# EAGLE design eTapper1main8 (EAGLE 8.2.2)
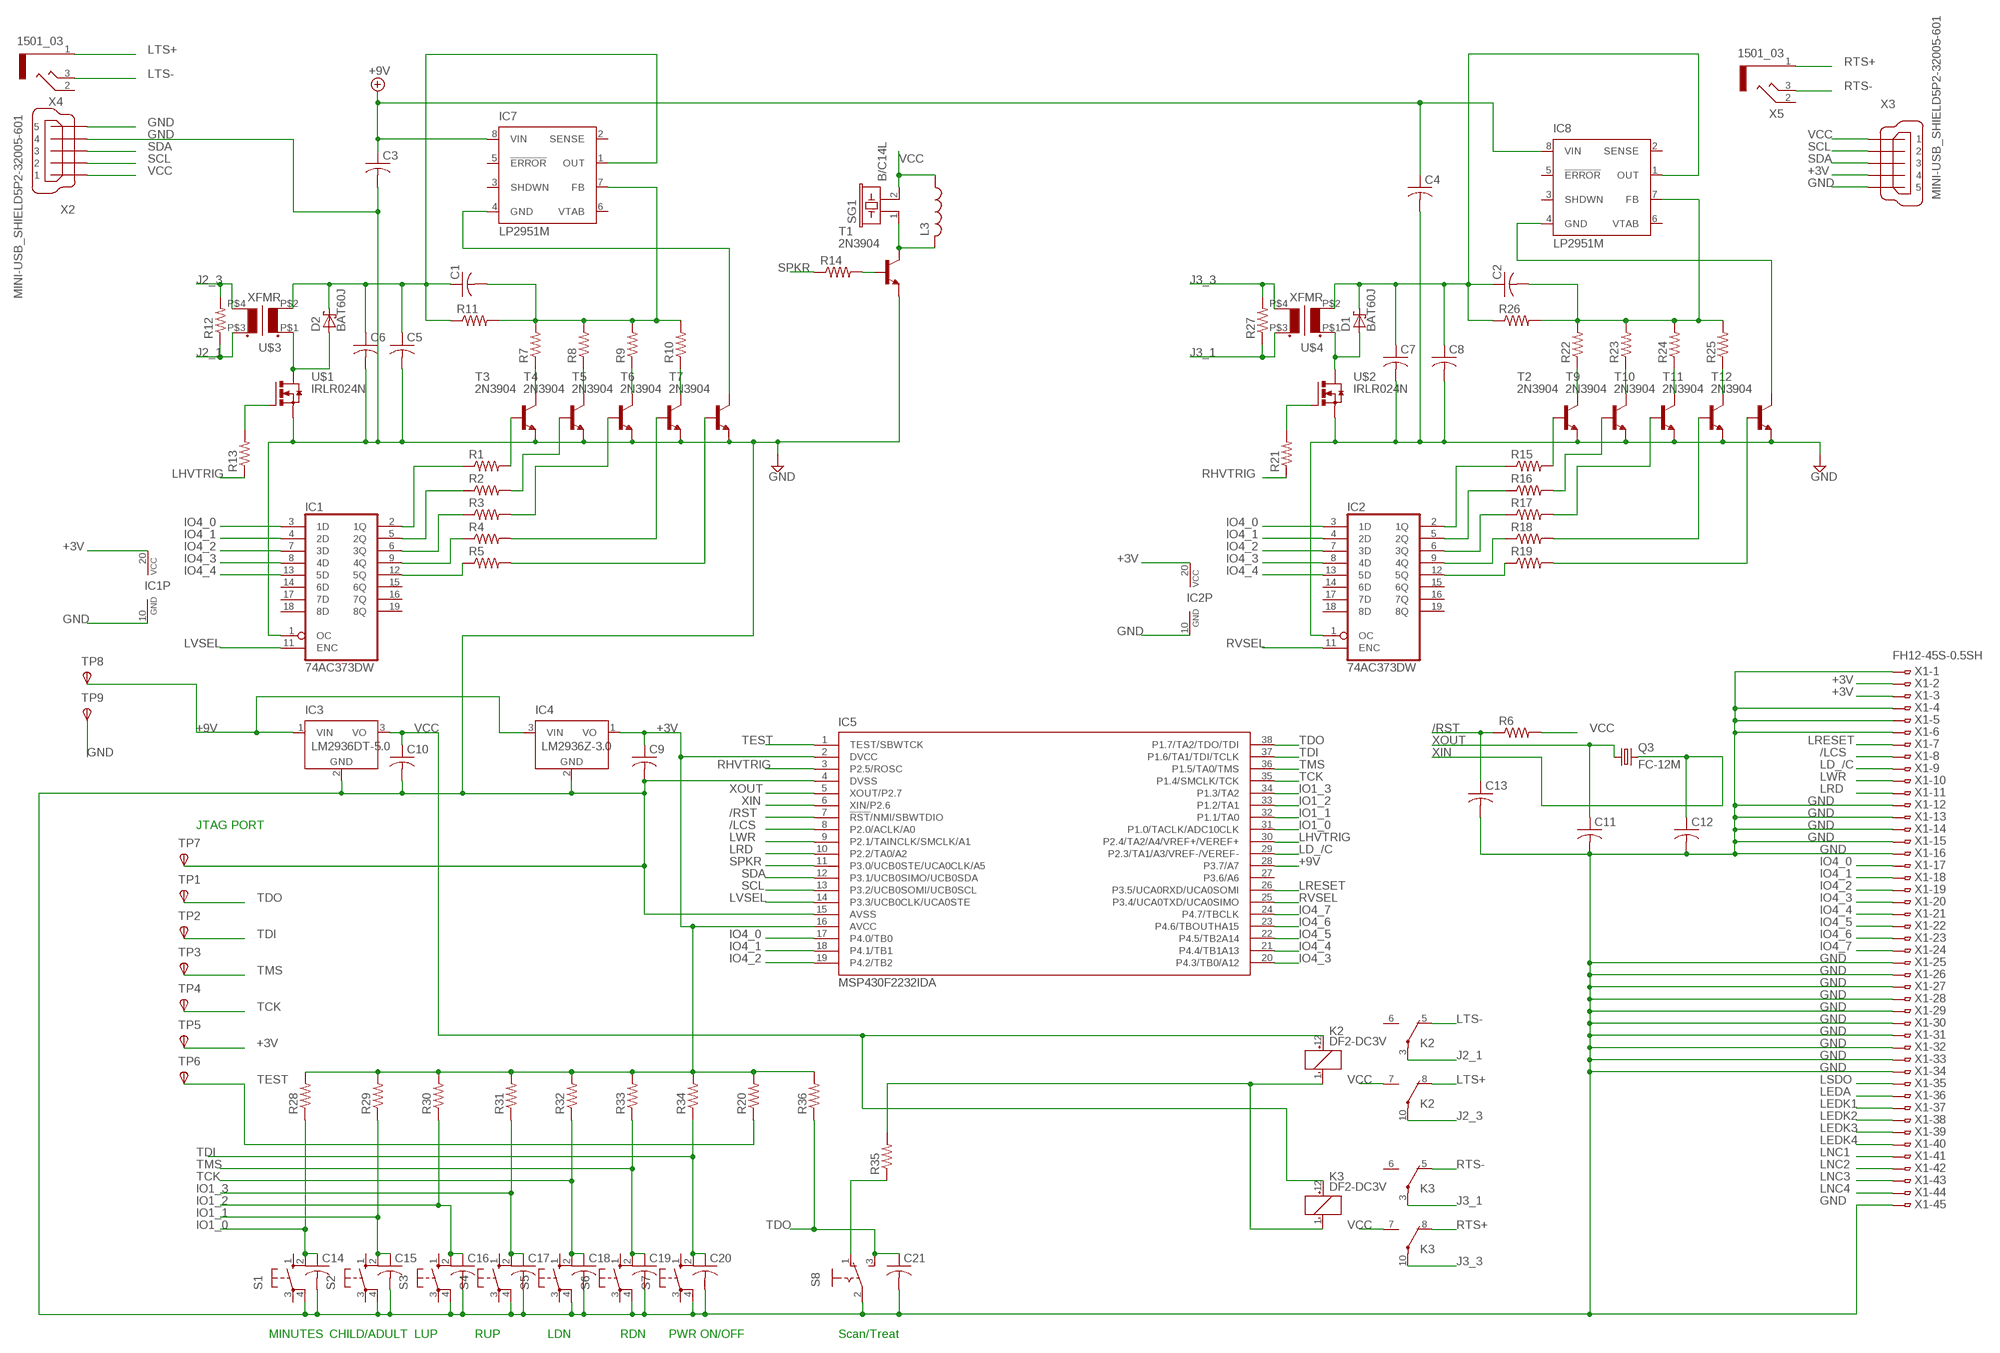
[diagram p0: schematic, sheet 1]

## Parts
C1  C-USC0805  [C0805]
C2  C-USC0805  [C0805]
C3  C-USC0805  [C0805]
C4  C-USC0805  [C0805]
C5  C-USC0805  [C0805]
C6  C-USC0805  [C0805]
C7  C-USC0805  [C0805]
C8  C-USC0805  [C0805]
C9  C-USC0805  [C0805]
C10  C-USC0805  [C0805]
C11  C-USC0805  [C0805]
C12  C-USC0805  [C0805]
C13  C-USC0805  [C0805]
C14  C-USC0805  [C0805]
C15  C-USC0805  [C0805]
C16  C-USC0805  [C0805]
C17  C-USC0805  [C0805]
C18  C-USC0805  [C0805]
C19  C-USC0805  [C0805]
C20  C-USC0805  [C0805]
C21  C-USC0805  [C0805]
D1  BAT60J  [SOD323_ST]
D2  BAT60J  [SOD323_ST]
IC1  74AC373DW  [SO20W]
IC2  74AC373DW  [SO20W]
IC3  LM2936DT-5.0  [TO252]
IC4  LM2936Z-3.0  [TO92]
IC5  MSP430F2232IDA  [TSSOP38_R-PDSO-G38-DA]
IC7  LP2951M  [SO08]
IC8  LP2951M  [SO08]
K2  DF2-DC3V  [DF2]
K3  DF2-DC3V  [DF2]
L3  L-USL2825P  [L2825P]
Q3  FC-12M  [FC-12M]
R1  R-US_R0402  [R0402]
R2  R-US_R0402  [R0402]
R3  R-US_R0402  [R0402]
R4  R-US_R0402  [R0402]
R5  R-US_R0402  [R0402]
R6  R-US_R0402  [R0402]
R7  R-US_R0402  [R0402]
R8  R-US_R0402  [R0402]
R9  R-US_R0402  [R0402]
R10  R-US_R0402  [R0402]
R11  R-US_R0402  [R0402]
R12  R-US_R0402  [R0402]
R13  R-US_R0402  [R0402]
R14  R-US_R0402  [R0402]
R15  R-US_R0402  [R0402]
R16  R-US_R0402  [R0402]
R17  R-US_R0402  [R0402]
R18  R-US_R0402  [R0402]
R19  R-US_R0402  [R0402]
R20  R-US_R0402  [R0402]
R21  R-US_R0402  [R0402]
R22  R-US_R0402  [R0402]
R23  R-US_R0402  [R0402]
R24  R-US_R0402  [R0402]
R25  R-US_R0402  [R0402]
R26  R-US_R0402  [R0402]
R27  R-US_R0402  [R0402]
R28  R-US_R0402  [R0402]
R29  R-US_R0402  [R0402]
R30  R-US_R0402  [R0402]
R31  R-US_R0402  [R0402]
R32  R-US_R0402  [R0402]
R33  R-US_R0402  [R0402]
R34  R-US_R0402  [R0402]
R35  R-US_R0402  [R0402]
R36  R-US_R0402  [R0402]
S1  10-XX  [B3F-10XX]
S2  10-XX  [B3F-10XX]
S3  10-XX  [B3F-10XX]
S4  10-XX  [B3F-10XX]
S5  10-XX  [B3F-10XX]
S6  10-XX  [B3F-10XX]
S7  10-XX  [B3F-10XX]
S8  M251  [M251]
SG1  B/C14L  [B/C14L]
T1  2N3904  [TO92]
T2  2N3904  [TO92]
T3  2N3904  [TO92]
T4  2N3904  [TO92]
T5  2N3904  [TO92]
T6  2N3904  [TO92]
T7  2N3904  [TO92]
T9  2N3904  [TO92]
T10  2N3904  [TO92]
T11  2N3904  [TO92]
T12  2N3904  [TO92]
TP1  TPSTP06R  [TP06R]
TP2  TPSTP06R  [TP06R]
TP3  TPSTP06R  [TP06R]
TP4  TPSTP06R  [TP06R]
TP5  TPSTP06R  [TP06R]
TP6  TPSTP06R  [TP06R]
TP7  TPSTP06R  [TP06R]
TP8  TPSTP06R  [TP06R]
TP9  TPSTP06R  [TP06R]
U$1  IRLR024N  [I-PAK_TO251AA]
U$2  IRLR024N  [I-PAK_TO251AA]
U$3  XFMR  [XFMR]
U$4  XFMR  [XFMR]
X1  FH12-45S-0.5SH  [FH12-45S-0.5SH]
X2  MINI-USB_SHIELD5P2-32005-601  [32005-601]
X3  MINI-USB_SHIELD5P2-32005-601  [32005-601]
X4  1501_03  [1501_03]
X5  1501_03  [1501_03]

## Nets
+3V: C9.1 IC1.20(VCC) IC2.20(VCC) IC4.1(VO) IC5.2(DVCC) IC5.16(AVCC) R20.2 R28.2 R29.2 R30.2 R31.2 R32.2 R33.2 R34.2 R36.2 TP5.TP(PP) X1.2 X1.3 X3.4
+9V: C3.1 C4.1 IC3.1(VIN) IC4.3(VIN) IC5.28(P3.7/A7) IC7.8(VIN) IC8.8(VIN) TP8.TP(PP)
/LCS: IC5.8(P2.0/ACLK/A0) X1.8
/RST: C13.1 IC5.7(!RST!/NMI/SBWTDIO) R6.1
GND: C3.2 C4.2 C5.2 C6.2 C7.2 C8.2 C9.2 C10.2 C11.2 C12.2 C13.2 C14.2 C15.2 C16.2 C17.2 C18.2 C19.2 C20.2 C21.2 IC1.1(OC) IC1.10(GND) IC2.1(OC) IC2.10(GND) IC3.2(GND) IC4.2(GND) IC5.4(DVSS) IC5.15(AVSS) S1.4(P1) S2.4(P1) S3.4(P1) S4.4(P1) S5.4(P1) S6.4(P1) S7.4(P1) S8.2(P) T1.3(E) T2.3(E) T3.3(E) T4.3(E) T5.3(E) T6.3(E) T7.3(E) T9.3(E) T10.3(E) T11.3(E) T12.3(E) TP7.TP(PP) TP9.TP(PP) U$1.3(S) U$2.3(S) X1.1 X1.4 X1.5 X1.6 X1.12 X1.13 X1.14 X1.15 X1.16 X1.25 X1.26 X1.27 X1.28 X1.29 X1.30 X1.31 X1.32 X1.33 X1.34 X1.45 X2.4 X2.5 X3.5
IO1_0: C14.1 IC5.31(P1.0/TACLK/ADC10CLK) R28.1 S1.2(S1)
IO1_1: C15.1 IC5.32(P1.1/TA0) R29.1 S2.2(S1)
IO1_2: C16.1 IC5.33(P1.2/TA1) R30.1 S3.2(S1)
IO1_3: C17.1 IC5.34(P1.3/TA2) R31.1 S4.2(S1)
IO4_0: IC1.3(1D) IC2.3(1D) IC5.17(P4.0/TB0) X1.17
IO4_1: IC1.4(2D) IC2.4(2D) IC5.18(P4.1/TB1) X1.18
IO4_2: IC1.7(3D) IC2.7(3D) IC5.19(P4.2/TB2) X1.19
IO4_3: IC1.8(4D) IC2.8(4D) IC5.20(P4.3/TB0/A12) X1.20
IO4_4: IC1.13(5D) IC2.13(5D) IC5.21(P4.4/TB1A13) X1.21
IO4_5: IC5.22(P4.5/TB2A14) X1.22
IO4_6: IC5.23(P4.6/TBOUTHA15) X1.23
IO4_7: IC5.24(P4.7/TBCLK) X1.24
J2_1: K2.3(2:P) R12.1 U$3.P$3(S1)
J2_3: K2.10(3:P) R12.2 U$3.P$4(S2)
J3_1: K3.3(2:P) R27.1 U$4.P$3(S1)
J3_3: K3.10(3:P) R27.2 U$4.P$4(S2)
LD_/C: IC5.29(P2.3/TA1/A3/VREF-/VEREF-) X1.9
LEDA: X1.36
LEDK1: X1.37
LEDK2: X1.38
LEDK3: X1.39
LEDK4: X1.40
LHVTRIG: IC5.30(P2.4/TA2/A4/VREF+/VEREF+) R13.1
LNC1: X1.41
LNC2: X1.42
LNC3: X1.43
LNC4: X1.44
LRD: IC5.10(P2.2/TA0/A2) X1.11
LRESET: IC5.26(P3.5/UCA0RXD/UCA0SOMI) X1.7
LSDO: X1.35
LTS+: K2.8(3:O) X4.1
LTS-: K2.5(2:O) X4.3
LVSEL: IC1.11(ENC) IC5.14(P3.3/UCB0CLK/UCA0STE)
LWR: IC5.9(P2.1/TAINCLK/SMCLK/A1) X1.10
N$1: IC1.2(1Q) R1.1
N$2: IC1.5(2Q) R2.1
N$3: IC1.6(3Q) R3.1
N$4: IC1.9(4Q) R4.1
N$5: IC1.12(5Q) R5.1
N$6: L3.2 SG1.1 T1.1(C)
N$7: R4.2 T6.2(B)
N$8: R5.2 T7.2(B)
N$9: D2.A U$1.2(D) U$1.4(D) U$3.P$1(P1)
N$10: R7.1 T3.1(C)
N$11: R8.1 T4.1(C)
N$12: R9.1 T5.1(C)
N$13: R1.2 T3.2(B)
N$14: R2.2 T4.2(B)
N$15: R3.2 T5.2(B)
N$16: R10.1 T6.1(C)
N$17: C1.2 IC7.7(FB) R7.2 R8.2 R9.2 R10.2 R11.2
N$18: C1.1 C5.1 C6.1 D2.C IC7.1(OUT) R11.1 U$3.P$2(P2)
N$19: D1.A U$2.2(D) U$2.4(D) U$4.P$1(P1)
N$20: IC2.2(1Q) R15.1
N$21: R13.2 U$1.1(G)
N$22: R14.2 T1.2(B)
N$23: R35.1 S8.1(O)
N$24: IC2.5(2Q) R16.1
N$25: IC2.6(3Q) R17.1
N$26: IC2.9(4Q) R18.1
N$27: IC2.12(5Q) R19.1
N$29: R15.2 T2.2(B)
N$30: R16.2 T9.2(B)
N$31: R17.2 T10.2(B)
N$32: R18.2 T11.2(B)
N$33: R19.2 T12.2(B)
N$34: K2.1(1:-) K3.1(1:-) R35.2
N$35: R22.1 T2.1(C)
N$36: R23.1 T9.1(C)
N$37: R24.1 T10.1(C)
N$38: R25.1 T11.1(C)
N$39: C2.2 IC8.7(FB) R22.2 R23.2 R24.2 R25.2 R26.2
N$40: C2.1 C7.1 C8.1 D1.C IC8.1(OUT) R26.1 U$4.P$2(P2)
N$42: R21.2 U$2.1(G)
N$45: IC7.4(GND) T7.1(C)
N$47: IC8.4(GND) T12.1(C)
RHVTRIG: IC5.3(P2.5/ROSC) R21.1
RTS+: K3.8(3:O) X5.1
RTS-: K3.5(2:O) X5.3
RVSEL: IC2.11(ENC) IC5.25(P3.4/UCA0TXD/UCA0SIMO)
SCL: IC5.13(P3.2/UCB0SOMI/UCB0SCL) X2.2 X3.2
SDA: IC5.12(P3.1/UCB0SIMO/UCB0SDA) X2.3 X3.3
SPKR: IC5.11(P3.0/UCB0STE/UCA0CLK/A5) R14.1
TCK: C18.1 IC5.35(P1.4/SMCLK/TCK) R32.1 S5.2(S1) TP4.TP(PP)
TDI: C20.1 IC5.37(P1.6/TA1/TDI/TCLK) R34.1 S7.2(S1) TP2.TP(PP)
TDO: C21.1 IC5.38(P1.7/TA2/TDO/TDI) R36.1 S8.3(S) TP1.TP(PP)
TEST: IC5.1(TEST/SBWTCK) R20.1 TP6.TP(PP)
TMS: C19.1 IC5.36(P1.5/TA0/TMS) R33.1 S6.2(S1) TP3.TP(PP)
VCC: C10.1 IC3.3(VO) K2.7(3:S) K2.12(1:+) K3.7(3:S) K3.12(1:+) L3.1 R6.2 SG1.2 X2.1 X3.1
XIN: C12.1 IC5.6(XIN/P2.6) Q3.2
XOUT: C11.1 IC5.5(XOUT/P2.7) Q3.1
Unconnected: IC1.14(6D) IC1.15(6Q) IC1.16(7Q) IC1.17(7D) IC1.18(8D) IC1.19(8Q) IC2.14(6D) IC2.15(6Q) IC2.16(7Q) IC2.17(7D) IC2.18(8D) IC2.19(8Q) IC5.27(P3.6/A6) IC7.2(SENSE) IC7.3(SHDWN) IC7.5(!ERROR) IC7.6(VTAB) IC8.2(SENSE) IC8.3(SHDWN) IC8.5(!ERROR) IC8.6(VTAB) K2.6(2:S) K3.6(2:S) S1.1(S) S1.3(P) S2.1(S) S2.3(P) S3.1(S) S3.3(P) S4.1(S) S4.3(P) S5.1(S) S5.3(P) S6.1(S) S6.3(P) S7.1(S) S7.3(P) X2.M1(S1) X2.M2(S2) X3.M1(S1) X3.M2(S2) X4.2 X5.2

## Notes on the sheet
- JTAG PORT
- MINUTES | CHILD/ADULT | LUP | RUP | LDN | RDN | PWR ON/OFF | Scan/Treat

## Library data of the parts
C1-C21 = rcl:C-US: CAPACITOR, American symbol
D1 D2 = diode:BAT60J: Schottky barrier diode Source: www.st.com, BAT60J.pdf
IC1 IC2 = 74xx-eu:74*373: Octal D type transparent LATCH, edge triggered
IC3 = national-semiconductor:LM2936?*: Ultra-Low Quiescent Current LDO Voltage Regulator Source: Data sheet <http://www.national.com/ds/LM/LM2936.pdf>; MF: NATIONAL SEMICONDUCTOR; MPN: LM2936DT-5.0/NOPB; OC_FARNELL: 1286864; OC_NEWARK: 41K4501
IC4 = national-semiconductor:LM2936?*: Ultra-Low Quiescent Current LDO Voltage Regulator Source: Data sheet <http://www.national.com/ds/LM/LM2936.pdf>; MF: NATIONAL SEMICONDUCTOR; MPN: LM2936Z-3.0/NOPB; OC_FARNELL: 1312709; OC_NEWARK: 41K4531
IC5 = texas:MSP430F22*2IDA: MIXED SIGNAL MICROCONTROLLER Source: http://focus.ti.com/lit/ds/symlink/msp430f2274.pdf; MPN: MSP430F2232IDA; OC_FARNELL: 1610178; OC_NEWARK: 28M6312
IC7 IC8 = national-semiconductor:LP2951: Adjustable Micropower Voltage Regulator Source: http://www.national.com/ds/LP/LP2950.pdf; MF: FAIRCHILD SEMICONDUCTOR; MPN: LP2951CM; OC_FARNELL: 9488561; OC_NEWARK: 78K6014
K2 K3 = relay:DF2-?DC*: HIGHLY SENSITIVE DIP MINIATURE RELAY NAiS Single side stable / 1 coil latching Source: http://www.mew-europe.com/.. en_ds_61002_0000.pdf; OC_FARNELL: unknown; OC_NEWARK: unknown
L3 = rcl:L-US: INDUCTOR, American symbol
Q3 = crystal:FC-12M: kHz RANGE CRYSTAL UNIT LOW PROFILE SMD Source: Epson Toyocom FC-12M.pdf
R1-R36 = resistor:R-US_: RESISTOR, American symbol
S1-S7 = switch-omron:10-XX: OMRON SWITCH; MPN: B3F-1000; OC_FARNELL: 176432; OC_NEWARK: 36M3542
S8 = switch:M251: SLIDING SWITCH Mors, distributor Buerklin, 11G702
SG1 = buzzer:B/C14L: BUZZER Source: Buerklin; OC_FARNELL: unknown; OC_NEWARK: unknown
T1-T7 T9-T12 = transistor-neu-to92:2N3904: NPN TRANSISTOR
TP1-TP9 = testpad:TPS: TEST PIN
U$1 U$2 = IRLR024N:IRLR024N: IRLR024N HEXFET Power Mosfet N channel Infeneon Technology TO-251AA IPAK
U$3 U$4 = XFMR:XFMR: Transformer 1"X1" 0.4"X0.4" hole separation for e_tapper
X1 = con-hirose:FH12-45S-0.5S: 0.5mm Pitch Connectors For FPC/FFC Source: Data sheet <http://www.hirose.co.jp/cataloge_hp/e58605370.pdf>; OC_FARNELL: unknown; OC_NEWARK: unknown
X2 X3 = con-cypressindustries:MINI-USB_SHIELD5P2-: MINI USB-B R/A DIP 5pol. Source: www.cypressindustries.com; OC_FARNELL: unknown; OC_NEWARK: unknown
X4 X5 = con-lumberg:1501_03: Klinkensteckverbinder nach JISC 6560, 2,5 mm Jack connectors according to JISC 6560, 2.5 mm Source: http://www.lumberg.com/Produkte/PDFs/1501_03.pdf; OC_FARNELL: 1200127; OC_NEWARK: unknown

## Module LP2951
Ports: 

### Library data of the parts

## Board
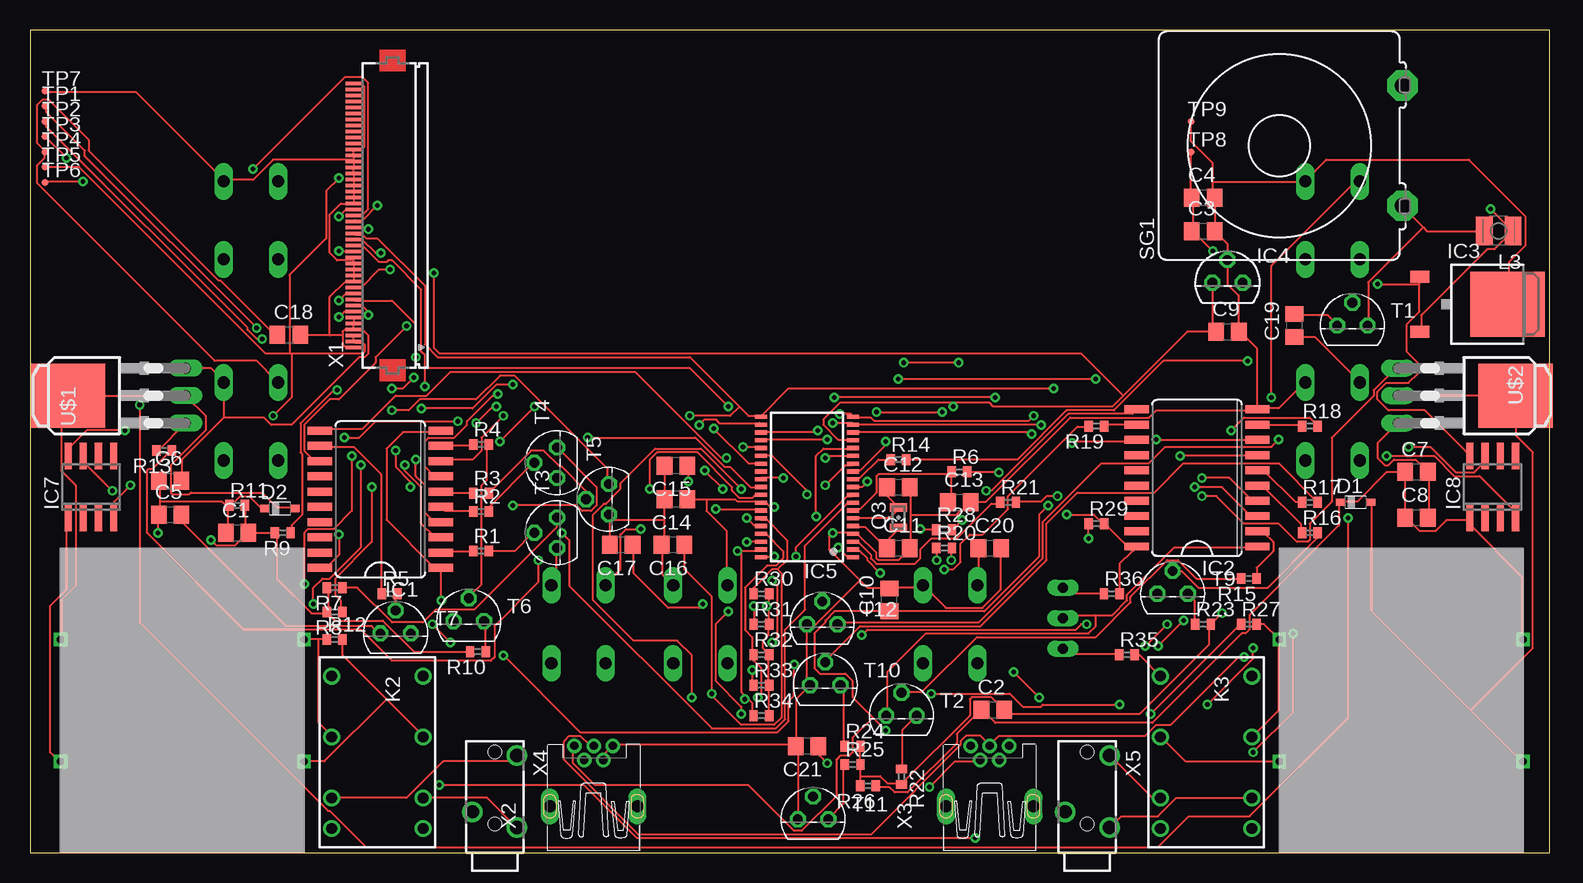
[diagram p1: board, top side]
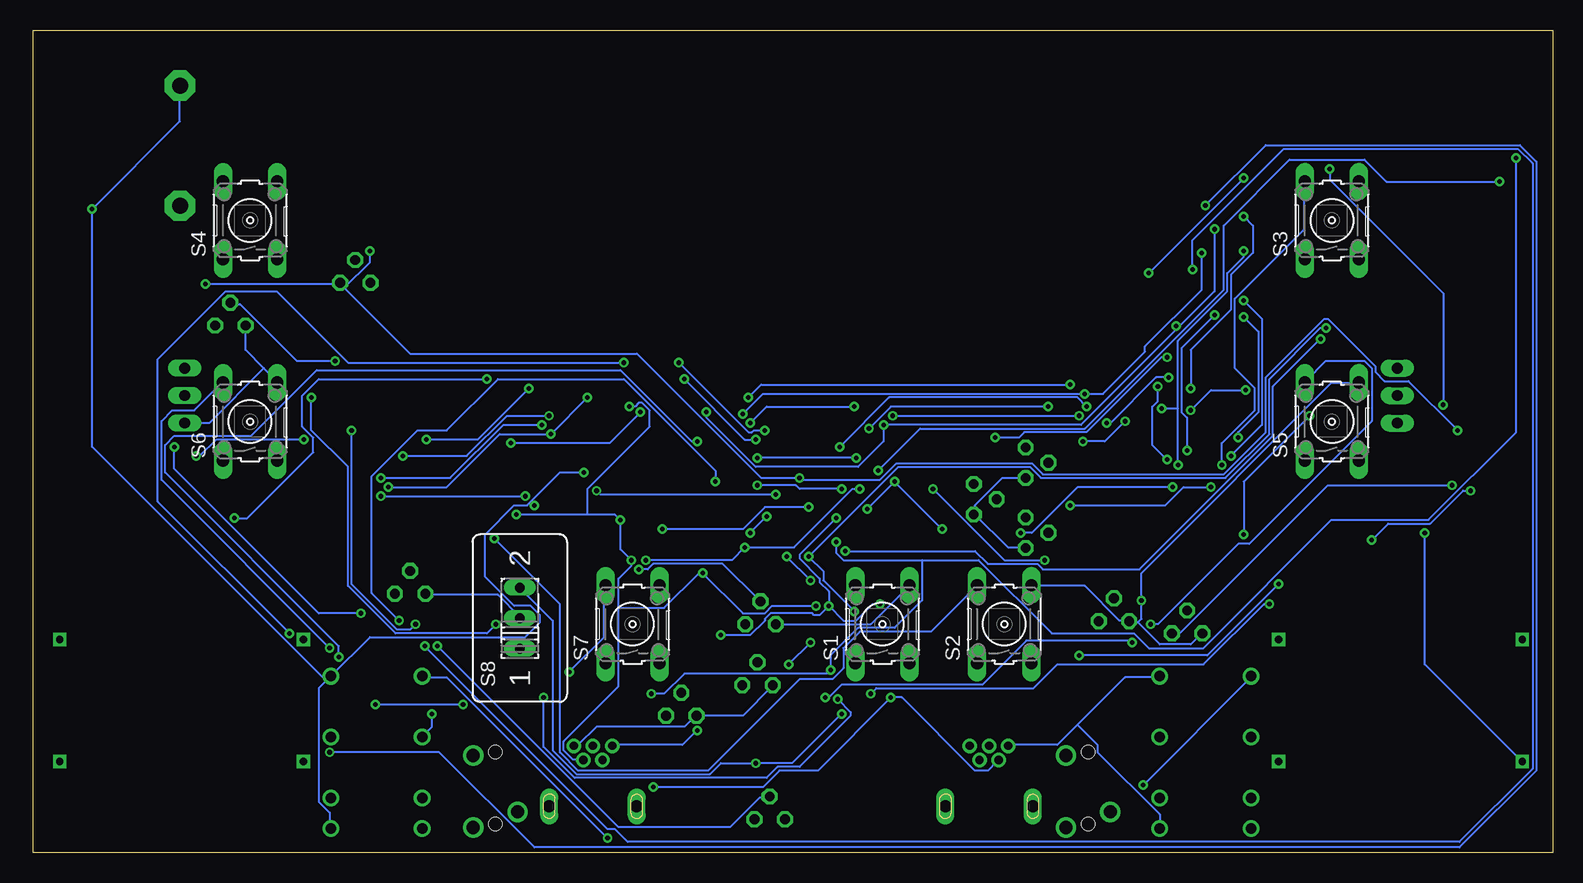
[diagram p2: board, bottom side, seen from below]

Size 126.67 x 68.57 mm. Coordinates in mm from the lower left corner, seen from the top.
Outline: 0,0 126.67,0 126.67,68.57 0,68.57 0,0
Copper layers (1*16): Top 0.035mm / dielectric 1.5mm / Bottom 0.035mm
Design rules "default *": minimum track width 6mil, minimum drill 15mil, track to track 6mil, track to pad 6mil, pad to pad 6mil, via to via 6mil, smd to smd 6mil, copper to edge 6mil, drill to drill 6mil, minimum pad ring 10mil, minimum via ring 8mil, stop-mask expansion 4mil, vias tented up to drill 0mil, thermal gap 10mil

### Footprints (pad centres in the part's own frame; a part is rotated, then mirrored left to right if it is on the bottom)
C0805 = smd 1.3 x 1.5: 1 -0.95,0; 2 0.95,0
SOD323_ST = smd 0.8 x 0.6: A 1.25,0; C -1.25,0
SO20W = smd 0.66 x 2.032: 1 -5.715,-5.029; 2 -4.445,-5.029; 3 -3.175,-5.029; 4 -1.905,-5.029; 5 -0.635,-5.029; 6 0.635,-5.029; 7 1.905,-5.029; 8 3.175,-5.029; 9 4.445,-5.029; 10 5.715,-5.029; 11 5.715,5.029; 12 4.445,5.029; 13 3.175,5.029; 14 1.905,5.029; 15 0.635,5.029; 16 -0.635,5.029; 17 -1.905,5.029; 18 -3.175,5.029; 19 -4.445,5.029; 20 -5.715,5.029
TO252 = smd 1 x 1.6: 1 -2.28,-4.8; 3 2.28,-4.8 | smd 5.4 x 6.2: 2 0,2.5
TO92 = drill 0.813 pad 1.27 octagon: 1 -1.27,0; 2 0,1.905; 3 1.27,0
TSSOP38_R-PDSO-G38-DA = smd 0.35 x 1: 1 -5.85,-3.85; 2 -5.2,-3.85; 3 -4.55,-3.85; 4 -3.9,-3.85; 5 -3.25,-3.85; 6 -2.6,-3.85; 7 -1.95,-3.85; 8 -1.3,-3.85; 9 -0.65,-3.85; 10 0,-3.85; 11 0.65,-3.85; 12 1.3,-3.85; 13 1.95,-3.85; 14 2.6,-3.85; 15 3.25,-3.85; 16 3.9,-3.85; 17 4.55,-3.85; 18 5.2,-3.85; 19 5.85,-3.85; 20 5.85,3.85; 21 5.2,3.85; 22 4.55,3.85; 23 3.9,3.85; 24 3.25,3.85; 25 2.6,3.85; 26 1.95,3.85; 27 1.3,3.85; 28 0.65,3.85; 29 0,3.85; 30 -0.65,3.85; 31 -1.3,3.85; 32 -1.95,3.85; 33 -2.6,3.85; 34 -3.25,3.85; 35 -3.9,3.85; 36 -4.55,3.85; 37 -5.2,3.85; 38 -5.85,3.85
SO08 = smd 0.6 x 2.2: 1 -1.905,-2.6; 2 -0.635,-2.6; 3 0.635,-2.6; 4 1.905,-2.6; 5 1.905,2.6; 6 0.635,2.6; 7 -0.635,2.6; 8 -1.905,2.6
DF2 = drill 0.9: 1 -6.35,-3.81; 3 -1.27,-3.81; 5 3.81,-3.81; 6 6.35,-3.81; 7 6.35,3.81; 8 3.81,3.81; 10 -1.27,3.81; 12 -6.35,3.81
L2825P = smd 1.4 x 2.4: 1 -1.2,0; 2 1.2,0
FC-12M = smd 0.7 x 1.4: 1 -0.85,0; 2 0.85,0
R0402 = smd 0.7 x 0.9: 1 -0.65,0; 2 0.65,0
B3F-10XX = drill 1.016 long: 1 -3.251,2.261; 2 3.251,2.261; 3 -3.251,-2.261; 4 3.251,-2.261
M251 = drill 0.813 long: 1 -2.54,0; 2 0,0; 3 2.54,0
B/C14L = drill 1.321 pad 2.54 octagon: 1 -5.004,-10.287; 2 5.004,-10.287
TO92' = drill 0.813 octagon: 1 1.27,0; 2 0,1.905; 3 -1.27,0
TP06R = smd 0.6 x 0.6: TP 0,0
I-PAK_TO251AA = drill 0.889 long: 1 -2.286,-5.334; 2 0,-5.334; 3 2.286,-5.334 | smd 5.334 x 6.223: 4 0,4.445
XFMR = drill 0.6 square: P$1 -10.16,5.08; P$2 -10.16,-5.08; P$3 10.16,5.08; P$4 10.16,-5.08
FH12-45S-0.5SH = smd 0.3 x 1.3: 1 -13,3.25; 2 -12.5,3.25; 3 -12,3.25; 4 -11.5,3.25; 5 -11,3.25; 6 -10.5,3.25; 7 -10,3.25; 8 -9.5,3.25; 9 -9,3.25; 10 -8.5,3.25; 11 -8,3.25; 12 -7.5,3.25; 13 -7,3.25; 14 -6.5,3.25; 15 -6,3.25; 16 -5.5,3.25; 17 -5,3.25; 18 -4.5,3.25; 19 -4,3.25; 20 -3.5,3.25; 21 -3,3.25; 22 -2.5,3.25; 23 -2,3.25; 24 -1.5,3.25; 25 -1,3.25; 26 -0.5,3.25; 27 0,3.25; 28 0.5,3.25; 29 1,3.25; 30 1.5,3.25; 31 2,3.25; 32 2.5,3.25; 33 3,3.25; 34 3.5,3.25; 35 4,3.25; 36 4.5,3.25; 37 5,3.25; 38 5.5,3.25; 39 6,3.25; 40 6.5,3.25; 41 7,3.25; 42 7.5,3.25; 43 8,3.25; 44 8.5,3.25; 45 9,3.25
32005-601 = drill 0.7 pad 1.016: 1 2.825,1.6; 2 1.625,0.8; 3 2.825,0; 4 1.625,-0.8; 5 2.825,-1.6 | drill 1 pad 1.422 long: M1 -2.225,3.65; M2 -2.225,-3.65
1501_03 = drill 1.1 pad 1.7: 1 -1.85,0.3; 2 1.85,-1; 3 -1.85,-5.7 | hole 1.1: 0,0; 0,-6

### Placement (x,y rotation side)
C1  17.27,26.67 0 top
C2  80.26,11.94 0 top
C3  97.79,51.82 0 top
C4  97.79,54.61 0 top
C5  11.68,28.19 0 top
C6  11.68,30.99 0 top
C7  115.57,31.75 0 top
C8  115.57,27.94 0 top
C9  99.82,43.43 0 top
C10  71.63,21.08 90 top
C11  72.39,25.4 0 top
C12  72.39,30.48 0 top
C13  77.47,29.21 0 top
C14  53.85,29.46 180 top
C15  53.85,32.26 180 top
C16  53.59,25.65 180 top
C17  49.28,25.65 180 top
C18  21.59,43.18 0 top
C19  105.41,43.94 90 top
C20  80.01,25.4 0 top
C21  64.77,8.89 180 top
D1  110.49,29.21 0 top
D2  20.83,28.7 0 top
IC1  29.21,29.46 90 top
IC2  97.28,31.24 90 top
IC3  120.65,45.72 270 top
IC4  99.82,47.5 0 top
IC5  64.77,30.48 90 top
IC7  5.08,30.48 0 top
IC8  121.92,30.48 0 top
K2  28.96,8.38 270 top
K3  98.04,8.38 270 top
L3  122.43,51.82 180 top
Q3  72.39,27.94 90 top
R1  37.59,25.15 0 top
R2  37.59,28.45 0 top
R3  37.59,29.97 0 top
R4  37.59,34.04 0 top
R5  29.97,21.59 0 top
R6  77.47,31.75 0 top
R7  25.4,22.1 180 top
R8  25.4,20.07 180 top
R9  21.08,26.67 180 top
R10  37.34,16.76 180 top
R11  17.27,28.96 0 top
R12  25.4,17.78 0 top
R13  11.18,33.53 180 top
R14  72.39,32.77 0 top
R15  101.6,22.86 180 top
R16  106.68,26.67 0 top
R17  106.68,29.21 0 top
R18  106.68,35.56 0 top
R19  88.9,35.56 180 top
R20  76.2,25.4 0 top
R21  81.53,29.21 0 top
R22  72.64,6.35 270 top
R23  97.79,19.05 0 top
R24  68.58,8.89 0 top
R25  68.58,7.37 0 top
R26  69.85,5.59 180 top
R27  101.6,19.05 0 top
R28  76.2,26.92 0 top
R29  88.9,27.43 0 top
R30  60.96,21.59 0 top
R31  60.96,19.05 0 top
R32  60.96,16.51 0 top
R33  60.96,13.97 0 top
R34  60.96,11.43 0 top
R35  91.44,16.51 0 top
R36  90.17,21.59 0 top
S1  55.88,19.05 90 bottom
S2  45.72,19.05 90 bottom
S3  18.41,52.7 90 bottom
S4  108.58,52.7 90 bottom
S5  18.41,35.94 90 bottom
S6  108.58,35.94 90 bottom
S7  76.71,19.05 90 bottom
S8  86.11,19.56 90 bottom
SG1  104.14,58.93 90 top
T1  2N3904  [TO92']  110.24,43.94 0 top
T2  2N3904  [TO92']  72.64,11.43 0 top
T3  2N3904  [TO92']  43.94,26.67 90 top
T4  2N3904  [TO92']  43.94,32.51 90 top
T5  2N3904  [TO92']  48.26,29.46 90 top
T6  2N3904  [TO92']  36.58,19.3 0 top
T7  2N3904  [TO92']  30.48,18.29 0 top
T9  2N3904  [TO92']  95.25,21.59 0 top
T10  2N3904  [TO92']  66.29,13.97 0 top
T11  2N3904  [TO92']  65.28,2.79 0 top
T12  2N3904  [TO92']  66.04,19.05 0 top
TP1  1.27,62.23 0 top
TP2  1.27,60.96 0 top
TP3  1.27,59.69 0 top
TP4  1.27,58.42 0 top
TP5  1.27,57.15 0 top
TP6  1.27,55.88 0 top
TP7  1.27,63.5 0 top
TP8  96.77,58.42 0 top
TP9  96.77,60.96 0 top
U$1  7.62,38.1 90 top
U$2  119.38,38.1 270 top
U$3  12.7,12.7 0 top
U$4  114.3,12.7 180 top
X1  30.23,55.12 90 top
X2  46.99,6.1 90 top
X3  80.01,6.1 90 top
X4  38.73,2.41 180 top
X5  88.14,2.41 180 top

### Tracks (layer width: path | path; a pad name or v marks a point on that pad's centre or on a via)
+3V  (via drill 0.38)
  Top 0.152: TP5.TP 4.12,57.15 19.66,41.6 21.64,41.6 | 21.79,41.6 27.74,41.6 27.89,41.76 27.89,42.37 27.74,42.52 27.13,42.52 X1.2 26.98,42.67 26.98,42.98 X1.3 | 21.79,41.6 21.64,41.6 | v25.76,26.52 25.76,24.84 24.69,23.77 24.23,23.77 IC1.20 | v20.27,36.42 21.79,37.95 21.79,41.6 | 76.96,37.49 80.01,37.49 80.31,37.19 90.22,37.19 91.14,38.1 | 76.96,37.49 67.51,37.49 66.14,36.12 66.14,35.66 67.36,34.44 68.58,34.44 IC5.16 | 91.14,38.1 96.47,43.43 98.6,43.43 | 98.6,43.43 C9.1 98.75,43.43 | 98.6,43.43 98.6,47.4 IC4.1 | 61.57,20.57 61.57,21.49 R30.2 | 61.57,20.57 61.57,19.05 | R34.2 61.57,11.43 61.57,13.87 R33.2 61.57,14.02 61.57,16.46 R32.2 61.57,16.61 61.11,17.07 61.11,17.68 61.57,18.14 61.57,19.05 | 61.57,19.05 R31.2 | 91.9,25.15 92.2,25.45 IC2.20 | 91.9,25.15 90.83,24.08 90.83,21.64 R36.2 | 91.9,25.15 89.61,27.43 R29.2 89.46,27.43 88.7,28.19 v86.41,28.19 | v76.81,24.38 76.81,25.3 R20.2 | v77.72,27.74 76.96,26.98 R28.2 | v70.87,23.32 69.8,24.38 69.8,24.54 69.19,25.15 68.73,25.15 IC5.2 | v61.42,20.57 61.57,20.57 | v76.96,37.19 76.96,37.49 | 21.64,41.6 21.64,48.16 24.69,51.21 24.69,55.17 v25.76,56.24 | v33.68,48.31 33.68,42.06 34.14,41.6 87.63,41.6 91.14,38.1
  Bottom 0.152: v25.76,26.52 25.76,30.94 v20.27,36.42 | 77.88,20.42 77.88,13.87 82.45,9.3 82.45,8.53 81.69,7.77 80.92,7.77 X3.4 | 77.88,20.42 77.88,22.86 76.81,23.93 v76.81,24.38 77.72,25.3 v77.72,27.74 78.18,28.19 80.47,28.19 | 77.88,20.42 74.07,20.42 71.17,23.32 v70.87,23.32 67.51,19.96 65.68,19.96 65.08,20.57 v61.42,20.57 | 80.47,28.19 v86.41,28.19 | v76.96,37.19 76.5,37.19 76.2,37.49 75.89,37.49 75.29,36.88 75.29,35.51 80.47,30.33 80.47,28.19 | v33.68,48.31 v25.76,56.24
+9V  (via drill 0.38)
  Top 0.152: 115.82,47.4 115.82,45.11 114.76,44.04 114.76,41.76 115.67,40.84 115.67,39.93 114.91,39.17 113.08,39.17 112.32,38.41 112.32,37.8 113.23,36.88 116.28,36.88 119.94,33.22 IC8.8 | 115.82,47.4 115.82,47.85 IC3.1 | TP8.TP 96.77,54.71 C4.1 96.93,54.56 96.93,51.82 | v62.79,31.24 60.96,31.24 IC5.28 | v7.92,35.2 4.72,35.2 3.2,33.68 3.2,33.22 IC7.8 | v98.6,50.14 96.93,51.82 | 96.93,51.82 C3.1 | v112.32,47.4 115.82,47.4
  Bottom 0.152: 100.74,47.09 101.04,47.4 IC4.3 | 100.74,47.09 95.25,41.6 76.35,41.6 65.99,31.24 v62.79,31.24 62.64,31.09 56.08,31.09 54.71,32.46 43.43,32.46 42.52,31.55 27.43,31.55 23.93,35.05 23.93,39.62 19.05,44.5 18.75,44.5 14.78,40.54 14.78,40.08 14.02,39.32 12.04,39.32 v7.92,35.2 | v98.6,50.14 98.6,49.23 100.74,47.09 | 100.74,47.09 IC4.3 | v112.32,47.4 101.19,47.4 IC4.3
/LCS  (via drill 0.38)
  Top 0.152: v44.35,26.67 44.96,26.06 44.96,22.25 56.84,10.36 62.18,10.36 62.94,11.12 62.94,18.59 64.62,20.27 64.62,25.6 68.12,29.11 68.58,29.11 IC5.8 | v31.7,30.48 31.7,30.94 30.48,32.16 v30.48,33.53 | v28.19,44.81 28.19,45.11 27.74,45.57 27.13,45.57 X1.8
  Bottom 0.152: v44.35,26.67 43.43,26.67 39.62,30.48 v31.7,30.48 | v30.48,33.53 30.48,36.27 30.94,36.73 30.94,42.06 v28.19,44.81
/RST
  Top 0.152: 76.81,31.55 76.81,29.41 76.66,29.26 C13.1 | 76.81,31.55 76.81,31.7 R6.1 76.81,31.55 | 76.81,31.55 70.71,31.55 70.56,31.39 70.56,30.02 69.19,28.65 68.73,28.65 IC5.7
GND  (via drill 0.38)
  Top 0.152: 16.15,56.08 8.84,63.4 1.37,63.4 TP7.TP | 16.15,36.27 12.65,32.77 12.65,31.09 C6.2 | 16.15,36.27 S5.4 16.15,39.32 15.09,40.39 U$1.3 | 26.98,57.76 26.98,58.06 X1.33 26.98,58.22 26.98,58.52 X1.34 27.13,58.67 27.74,58.67 27.89,58.83 27.89,63.86 27.74,64.01 27.13,64.01 X1.45 | X1.14 26.98,49.07 X1.15 26.98,49.23 26.98,49.38 | 26.98,49.38 26.98,49.53 X1.16 | X1.14 26.98,48.16 X1.13 26.98,48.01 26.98,47.7 X1.12 26.98,47.55 26.21,47.55 24.99,46.33 24.99,43.13 | X1.14 | X1.6 26.98,44.5 26.98,44.2 X1.5 26.98,44.04 26.98,43.74 X1.4 | 26.06,43.13 26.06,43.43 26.21,43.59 26.98,43.59 X1.4 | 26.06,43.13 26.06,42.37 26.21,42.22 26.98,42.22 X1.1 | 26.06,43.13 24.99,43.13 | 24.99,43.13 22.55,43.13 C18.2 | 26.98,49.38 25.6,49.38 24.99,49.99 24.99,53.19 25.91,54.1 26.98,54.1 X1.25 26.98,54.25 26.98,54.56 X1.26 26.98,54.71 26.98,55.02 X1.27 26.98,55.17 26.98,55.47 X1.28 26.98,56.08 X1.29 26.98,56.24 26.98,56.54 X1.30 26.98,56.69 26.98,57 X1.31 26.98,57.15 26.98,57.61 X1.32 26.98,57.76 | 16.15,36.27 19.51,36.27 20.12,35.66 21.79,35.66 27.43,41.3 27.89,41.3 28.19,41.6 28.19,43.13 27.74,43.59 27.13,43.59 X1.4 | 16.15,56.08 18.59,56.08 20.27,57.76 26.98,57.76 | 16.15,56.08 S3.4 | C15.2 52.88,32.16 52.88,29.57 C14.2 52.88,29.41 52.88,27.74 | S1.4 53.49,22.4 52.73,23.16 52.73,25.6 C16.2 52.73,25.76 52.88,25.91 52.88,27.74 | T3.3 43.89,25.3 43.89,22.71 43.59,22.4 S2.4 | 48.31,27.74 48.31,28.19 T5.3 48.31,27.74 | 48.31,27.74 48.31,25.76 C17.2 | 48.31,27.74 52.88,27.74 | IC1.10 34.14,35.05 31.09,35.05 29.72,33.68 29.72,27.74 33.68,23.77 34.14,23.77 IC1.1 34.29,23.62 v34.29,21.03
  Top 0.152: C5.2 12.65,28.19 12.65,27.58 21.34,18.9 28.5,18.9 29.11,18.29 T7.3 | C8.2 116.59,28.04 116.59,31.7 C7.2 116.43,31.85 115.52,32.77 113.69,32.77 113.23,32.31 112.93,32.31 112.32,32.92 112.32,34.14 114,35.81 U$2.3 | C19.2 105.46,44.81 108.2,44.81 108.97,44.04 T1.3 | IC2.10 102.41,37.03 104.09,37.03 106.22,39.17 S6.4 | TP9.TP 96.77,59.28 98.6,57.45 98.6,55.93 | 98.6,55.93 98.6,54.71 C4.2 98.75,54.56 98.75,51.82 | 98.6,55.93 106.22,55.93 S4.4 106.38,56.08 108.05,57.76 119.94,57.76 124.66,53.03 124.66,50.6 123.29,49.23 123.29,45.72 IC3.2 | 98.75,51.82 99.82,50.75 IC4.2 99.82,47.4 100.74,46.48 100.74,43.43 C9.2 100.89,43.43 102.26,42.06 102.26,37.03 IC2.10 | 98.75,51.82 C3.2 | 71.63,22.1 74.22,22.1 74.37,22.25 S7.4 74.52,22.25 76.35,20.42 79.4,20.42 80.92,21.95 80.92,25.3 C20.2 | v65.53,28.04 65.53,33.07 66.14,33.68 68.58,33.68 IC5.15 | 73.46,28.19 73.46,25.45 C11.2 73.3,25.3 72.39,24.38 70.71,24.38 70.56,24.54 70.56,24.99 69.04,26.52 68.73,26.52 IC5.4 68.58,26.67 v66.9,26.67 66.6,26.36 66.6,25.3 69.19,22.71 | 73.46,28.19 73.46,30.48 C12.2 | 73.46,28.19 77.27,28.19 77.57,28.5 77.72,28.5 78.33,29.11 C13.2 78.49,29.26 79.7,29.26 86.72,36.27 93.27,36.27 93.88,36.88 102.26,36.88 IC2.10 | 71.63,22.1 69.8,22.1 69.19,22.71 | 71.63,22.1 C10.2 | 88.85,19.81 86.26,19.81 86.11,19.66 S8.2 | 88.85,19.81 90.22,19.81 91.44,21.03 91.44,21.49 95.4,25.45 102.26,25.45 IC2.1 | X2.4 47.85,7.77 47.85,8.23 48.46,8.84 X2.5 48.62,8.99 63.7,8.99 C21.2 | C21.2 63.86,8.99 63.86,12.8 T10.3 64.92,14.02 64.77,14.17 T12.3 65.53,19.05 69.19,22.71 | T11.3 64.01,8.69 63.86,8.84 C21.2
  Top 0.152: 88.85,19.81 88.85,18.9 88.24,18.29 74.68,18.29 71.48,15.09 71.48,11.43 T2.3
  Bottom 0.152: T4.3 45.87,31.24 48.16,28.96 48.16,28.19 | 48.16,28.19 45.41,25.45 44.04,25.45 T3.3 | 48.16,28.19 T5.3 | 34.59,19.2 35.2,19.2 T6.3 35.36,19.36 36.12,19.36 39.01,22.25 43.43,22.25 S2.4 | 34.59,19.2 32.77,17.37 30.18,17.37 29.26,18.29 T7.3 | 34.59,19.2 34.29,19.51 v34.29,21.03 34.29,23.32 18.44,39.17 16.15,39.17 S5.4 | T1.3 108.97,41.91 107.44,40.39 | 107.44,40.39 106.38,39.32 S6.4 | U$2.3 112.01,35.81 107.44,40.39 | v66.9,26.67 v65.53,28.04 | T9.3 93.88,21.49 87.94,21.49 86.11,19.66 S8.2 | X3.5 81.53,8.99 81.23,8.99 79.7,10.52 72.39,10.52 71.48,11.43 T2.3 67.51,11.43 65.08,13.87 T10.3 | T12.3 56.84,19.05 53.65,22.25 S1.4
IO1_0  (via drill 0.38)
  Top 0.152: v74.22,26.98 75.44,26.98 R28.1 | v62.03,28.8 61.72,28.8 61.42,29.11 60.96,29.11 IC5.31 60.81,29.26 58.98,29.26 58.83,29.41 56.39,29.41 | 56.39,29.41 54.86,29.41 C14.1 | 56.39,29.41 56.39,28.5 58.06,26.82 58.06,22.4 S1.2
  Bottom 0.152: v74.22,26.98 67.51,26.98 65.68,28.8 v62.03,28.8
IO1_1  (via drill 0.38)
  Top 0.152: v57.15,28.65 60.81,28.65 IC5.32 | v54.86,30.94 54.86,32.16 C15.1 | v88.24,26.21 R29.1 | v50.9,26.98 49.68,26.98 49.23,26.52 49.23,23.62 48.01,22.4 S2.2
  Bottom 0.152: v57.15,28.65 v54.86,30.94 v50.9,26.98 | v88.24,26.21 82.75,20.73 82.75,8.38 81.23,6.86 70.41,6.86 62.79,14.48 60.05,14.48 59.13,15.39 59.13,17.07 57.76,18.44 51.82,18.44 48.01,22.25 S2.2
IO1_2  (via drill 0.38)
  Top 0.152: 62.33,23.62 61.87,23.62 60.35,22.1 60.35,21.64 R30.1 | 62.33,23.62 63.09,24.38 63.09,26.06 61.42,27.74 60.96,27.74 IC5.33 | 62.33,23.62 62.64,23.32 62.64,11.28 62.03,10.67 59.28,10.67 56.84,13.11 v56.84,13.26 56.84,21.34 54.56,23.62 54.56,25.6 C16.1 | v27.58,32.31 27.58,25.45 24.99,22.86 24.38,22.86 23.62,22.1 v23.62,20.73
  Bottom 0.152: v27.58,32.31 27.58,34.14 24.84,36.88 24.84,38.71 26.52,40.39 26.52,46.18 20.73,51.97 20.73,55.93 S3.2 | v23.62,20.73 24.08,20.73 29.11,15.7 41.3,15.7 43.28,13.72 56.39,13.72 v56.84,13.26
IO1_3  (via drill 0.38)
  Top 0.152: v60.35,20.57 60.35,19.05 R31.1 | v59.74,27.89 60.35,27.28 60.81,27.28 IC5.34 | v56.08,20.73 55.78,20.42 53.19,20.42 50.29,23.32 50.29,25.6 C17.1 | v103.48,37.95 103.48,48.92 110.49,55.93 110.8,55.93 S4.2 | v88.09,19.05 87.63,19.05 87.17,18.59 69.8,18.59 v69.34,18.14
  Bottom 0.152: v60.35,20.57 60.35,21.79 61.11,22.55 61.11,22.86 62.79,24.54 62.79,24.84 v59.74,27.89 | v56.08,20.73 56.69,20.73 58.06,19.36 59.13,19.36 v60.35,20.57 | v103.48,37.95 103.48,35.2 100.43,32.16 100.43,22.25 96.47,18.29 88.85,18.29 v88.09,19.05 | v69.34,18.14 66.9,18.14 65.68,19.36 65.68,19.51 65.23,19.96 61.72,19.96 61.57,19.81 61.11,19.81 v60.35,20.57
IO4_0  (via drill 0.38)
  Top 0.152: v25.76,50.14 26.98,50.14 X1.17 | v31.24,32.31 31.24,31.85 32.61,30.48 32.61,27.43 33.68,26.36 34.14,26.36 IC1.3 | v83.52,34.9 83.36,35.05 68.73,35.05 IC5.17 | v97.08,30.48 99.36,30.48 101.65,28.19 102.26,28.19 IC2.3 | v32.61,37.03 36.88,37.03 38.86,39.01 v40.23,39.01 | v80.47,37.95 v67.06,37.95
  Bottom 0.152: v25.76,50.14 25.76,49.68 27.13,48.31 27.13,46.79 31.24,42.67 31.24,37.03 | v31.24,32.31 31.24,37.03 | v97.08,30.48 92.2,30.48 87.78,34.9 v83.52,34.9 v80.47,37.95 | v32.61,37.03 31.24,37.03 | v40.23,39.01 65.99,39.01 v67.06,37.95
IO4_1  (via drill 0.38)
  Top 0.152: v32.92,38.86 32.92,40.39 | 32.92,40.39 32.92,41.45 32.61,41.76 32.61,46.94 30.18,49.38 29.87,49.38 29.72,49.23 29.11,49.23 27.74,50.6 27.13,50.6 X1.18 | v32.16,32.77 32.16,31.39 32.92,30.63 32.92,28.35 33.68,27.58 34.14,27.58 IC1.4 | v84.28,35.66 68.73,35.66 IC5.18 68.58,35.81 v66.9,35.81 | v97.69,31.24 99.97,31.24 101.8,29.41 102.26,29.41 IC2.4 | 32.92,40.39 55.02,40.39 v58.22,37.19
  Bottom 0.152: v32.92,38.86 32.92,37.64 33.38,37.19 33.38,33.98 v32.16,32.77 | v84.28,35.66 87.48,35.66 91.9,31.24 v97.69,31.24 | v58.22,37.19 65.53,37.19 v66.9,35.81
IO4_2  (via drill 0.38)
  Top 0.152: v29.26,49.99 28.8,49.99 27.74,51.05 27.13,51.05 X1.19 | v39.01,38.25 38.71,38.25 36.42,35.97 36.42,35.66 35.36,34.59 33.22,34.59 32.92,34.29 32.92,32.16 33.68,31.39 34.14,31.39 IC1.7 | v83.67,36.42 83.21,35.97 70.41,35.97 70.1,36.27 68.73,36.27 IC5.19 68.58,36.42 68.43,36.58 v67.51,36.58 | v95.86,33.07 102.26,33.07 IC2.7
  Bottom 0.152: v29.26,49.99 29.26,46.94 33.98,42.22 33.98,41.76 37.49,38.25 v39.01,38.25 65.84,38.25 v67.51,36.58 | v83.67,36.42 87.17,36.42 90.53,33.07 v95.86,33.07
IO4_3  (via drill 0.38)
  Top 0.152: 59.13,37.19 55.02,41.3 33.98,41.3 32.92,42.37 32.92,47.24 28.96,51.21 28.04,51.21 27.74,51.51 27.13,51.51 X1.20 | 59.13,37.19 59.89,36.42 60.81,36.42 IC5.20 60.96,36.42 63.25,38.71 v85.34,38.71 | v39.47,36.42 37.64,34.59 37.64,33.53 36.88,32.77 34.29,32.77 IC1.8 | v55.02,36.42 58.37,36.42 59.13,37.19 | v93.88,34.44 102.26,34.44 IC2.8
  Bottom 0.152: v55.02,36.42 v39.47,36.42 | v93.88,34.44 89.61,34.44 v85.34,38.71
IO4_4  (via drill 0.38)
  Top 0.152: v55.78,35.66 56.24,36.12 57.15,36.12 57.45,35.81 60.81,35.81 IC5.21 | v28.19,51.97 27.89,51.97 27.74,52.12 27.13,52.12 X1.21 | v31.39,43.89 28.8,41.3 28.8,40.84 25.76,37.8 24.99,37.8 22.86,35.66 22.86,33.53 23.62,32.77 24.08,32.77 IC1.13 | v86.87,34.14 87.02,34.29 92.2,34.29 IC2.13 | v70.56,36.73 v76.05,36.73
  Bottom 0.152: 31.24,43.74 28.19,46.79 v28.19,51.97 | 31.24,43.74 39.32,35.66 v55.78,35.66 55.78,34.29 57.91,32.16 66.45,32.16 70.56,36.27 v70.56,36.73 | 31.24,43.74 v31.39,43.89 | v86.87,34.14 78.64,34.14 v76.05,36.73
IO4_5  (via drill 0.38)
  Top 0.152: v65.68,35.2 65.53,35.05 60.96,35.05 IC5.22 | v77.42,40.84 v72.85,40.84 | v105.31,18.29 105.31,11.73 v101.96,8.38 | v28.96,53.95 27.74,52.73 27.13,52.73 X1.22
  Bottom 0.152: v65.68,35.2 66.6,35.2 66.75,35.05 67.06,35.05 v72.85,40.84 | v77.42,40.84 100.43,40.84 106.38,46.79 110.64,46.79 116.28,41.15 116.28,29.26 v105.31,18.29 | v101.96,8.38 92.81,8.38 84.89,0.46 7.77,0.46 1.37,6.86 1.37,57.61 2.74,58.98 23.93,58.98 v28.96,53.95
IO4_6  (via drill 0.38)
  Top 0.152: v66.45,34.44 60.96,34.44 IC5.23 | v88.85,39.47 v72.39,39.47 | v109.88,27.89 109.88,11.28 101.65,3.05 96.62,3.05 94.03,0.46 28.04,0.46 24.99,3.5 24.84,3.5 9.14,19.2 v9.14,37.34 | v18.59,57 26.21,64.62 27.74,64.62 28.19,64.16 28.19,53.65 27.74,53.19 27.13,53.19 X1.23
  Bottom 0.152: v66.45,34.44 67.36,34.44 v72.39,39.47 | v88.85,39.47 102.87,39.47 104.24,38.1 104.24,35.51 103.33,34.59 103.33,33.38 108.81,27.89 v109.88,27.89 | v9.14,37.34 9.14,46.63 18.59,56.08 v18.59,57
IO4_7  (via drill 0.38)
  Top 0.152: v59.44,33.83 60.81,33.83 IC5.24 | v38.86,37.19 38.56,37.19 v37.19,35.81 | v32,39.62 31.09,38.71 v30.18,38.71 | v25.76,53.03 26.36,53.65 26.98,53.65 X1.24
  Bottom 0.152: v59.44,33.83 55.32,37.95 39.62,37.95 v38.86,37.19 | v37.19,35.81 36.88,35.81 33.07,39.62 v32,39.62 | v30.18,38.71 30.18,41.91 26.82,45.26 26.82,48.16 24.99,49.99 24.99,52.27 v25.76,53.03
J2_1
  Top 0.152: 24.08,17.83 22.86,17.83 U$3.P$3 | 24.08,17.83 24.69,17.83 R12.1 | 24.08,17.83 24.08,10.82 25.15,9.75 K2.3
J2_3
  Top 0.152: 29.72,12.8 32.77,9.75 K2.10 | 29.72,12.8 26.06,16.46 26.06,17.68 R12.2 | U$3.P$4 24.54,7.62 29.72,12.8
J3_1  (via drill 0.38)
  Top 0.152: v93.42,11.58 100.89,19.05 R27.1 | U$4.P$3 96.32,7.62 94.34,9.6 K3.3
  Bottom 0.152: v93.42,11.58 93.42,10.52 94.18,9.75 K3.3
J3_3
  Top 0.152: R27.2 102.87,19.05 U$4.P$4 104.09,17.68 104.09,11.89 K3.10
LD_/C  (via drill 0.38)
  Top 0.152: IC5.29 60.05,30.48 58.37,32.16 57.91,32.16 55.47,34.59 v46.48,34.59 | v32.16,41.3 32.16,44.04 30.18,46.02 27.13,46.02 X1.9
  Bottom 0.152: v46.48,34.59 44.5,34.59 44.04,35.05 38.86,35.05 32.61,41.3 v32.16,41.3
LHVTRIG  (via drill 0.38)
  Top 0.152: v42.37,24.38 42.37,22.55 38.71,18.9 38.71,16.31 38.41,16 30.18,16 27.58,18.59 17.83,18.59 9.75,26.67 9.75,31.85 9.91,32 10.21,32 11.73,33.53 R13.1 | v51.66,30.33 51.66,32.77 52.27,33.38 55.63,33.38 58.52,30.48 58.52,30.18 59.13,29.57 60.2,29.57 60.35,29.72 60.81,29.72 IC5.30
  Bottom 0.152: v42.37,24.38 45.72,24.38 v51.66,30.33
LRD  (via drill 0.38)
  Top 0.152: IC5.10 69.34,30.48 v69.8,30.94 | v94.03,17.22 v96.16,19.36 | v30.02,48.62 29.11,48.62 27.58,47.09 27.13,47.09 X1.11
  Bottom 0.152: v69.8,30.94 69.8,31.85 77.42,39.47 87.94,39.47 92.2,35.2 94.64,35.2 98.45,31.39 98.45,21.64 v96.16,19.36 | v94.03,17.22 78.79,1.98 78.18,1.98 77.11,0.91 7.77,0.91 1.68,7.01 1.68,57.45 2.9,58.67 22.4,58.67 30.02,51.05 v30.02,48.62
LRESET  (via drill 0.38)
  Top 0.152: v57,35.36 59.89,32.46 60.81,32.46 IC5.26 | v39.17,34.29 v42.06,37.19 | v35.66,35.97 28.8,35.97 27.43,34.59 v26.21,34.59 | v25.76,44.65 26.21,45.11 X1.7
  Bottom 0.152: v57,35.36 55.17,37.19 v42.06,37.19 | v39.17,34.29 37.34,34.29 v35.66,35.97 | v26.21,34.59 26.21,35.05 24.54,36.73 24.54,43.43 v25.76,44.65
LTS+
  Top 0.152: K2.8 38.1,4.57 40.54,2.13 X4.1
LTS-
  Top 0.152: K2.5 31.39,4.57 34.44,7.62 40.08,7.62 40.54,8.08 X4.3
LVSEL  (via drill 0.38)
  Top 0.152: v66.29,32.92 66.45,33.07 68.58,33.07 IC5.14 | v58.06,32.92 57.61,32.92 50.44,40.08 35.05,40.08 33.07,38.1 30.48,38.1 27.74,35.36 24.38,35.36 24.23,35.2 IC1.11
  Bottom 0.152: v58.06,32.92 v66.29,32.92
LWR  (via drill 0.38)
  Top 0.152: v63.86,24.69 63.86,25.45 68.12,29.72 68.58,29.72 IC5.9 | v61.87,22.71 62.33,22.25 62.33,17.98 v61.87,17.53 | v63.7,15.7 63.7,13.11 63.25,12.65 63.25,10.97 62.33,10.06 45.87,10.06 v39.47,16.46 | v22.86,22.4 22.86,26.67 23.16,26.98 25.3,26.98 26.82,28.5 v26.82,33.07 | v25.76,46.02 26.36,46.63 26.98,46.63 X1.10
  Bottom 0.152: v61.87,22.71 v63.86,24.69 | v63.7,15.7 v61.87,17.53 | v39.47,16.46 28.8,16.46 v22.86,22.4 | v26.82,33.07 24.23,35.66 24.23,44.5 v25.76,46.02
N$1
  Top 0.152: R1.1 34.29,25.15 IC1.2
N$2
  Top 0.152: R2.1 36.88,28.5 34.59,28.5 34.29,28.8 IC1.5
N$3
  Top 0.152: R3.1 36.88,30.02 34.29,30.02 IC1.6
N$4
  Top 0.152: R4.1 36.88,33.98 34.29,33.98 IC1.9
N$5
  Top 0.152: R5.1 29.26,21.64 29.26,31.55 26.98,33.83 24.23,33.83 IC1.12
N$6
  Top 0.152: L3.2 116.43,51.82 116.13,52.12 | 116.13,52.12 114.45,53.8 SG1.1 | 116.13,52.12 111.56,47.55 111.56,44.04 T1.1
N$7
  Top 0.152: R4.2 38.1,33.98 38.1,31.09 37.64,30.63 37.64,22.4 36.58,21.34 T6.2
N$8
  Top 0.152: T7.2 30.48,21.49 R5.2
N$9
  Top 0.152: D2.A 21.95,28.8 20.57,28.8 19.36,30.02 13.41,30.02 13.26,29.87 11.89,29.87 11.73,30.02 11.73,32.31 14.63,35.2 14.63,36.42 U$1.2 U$1.4 3.05,38.1 2.59,37.64 2.59,31.85 3.81,30.63 3.81,22.25 2.59,21.03 2.59,17.83 U$3.P$1
N$10
  Top 0.152: R7.1 27.28,22.1 30.18,19.2 32.77,19.2 33.83,20.27 37.03,20.27 43.89,27.13 43.89,27.89 T3.1
N$11  (via drill 0.38)
  Top 0.152: v28.5,30.48 28.5,25.91 25.45,22.86 25.45,21.49 25.91,21.03 25.91,20.12 R8.1 | v40.23,28.96 45.57,28.96 46.02,28.5 46.79,28.5 47.24,28.96 47.24,30.48 T4.1
  Bottom 0.152: v28.5,30.48 30.79,30.48 32.31,28.96 v40.23,28.96
N$12  (via drill 0.38)
  Top 0.152: v25.6,38.56 25.3,38.56 22.55,35.81 22.55,33.38 22.71,33.22 22.71,28.19 21.79,27.28 21.79,26.67 R9.1 | v30.18,36.88 31.55,36.88 32.46,37.8 37.19,37.8 39.17,39.78 40.39,39.78 48.16,32 48.16,30.79 T5.1
  Bottom 0.152: v25.6,38.56 28.5,38.56 v30.18,36.88
N$13
  Top 0.152: R1.2 40.39,25.15 41.91,26.67 T3.2
N$14
  Top 0.152: R2.2 38.25,28.5 38.25,28.8 41.91,32.46 T4.2
N$15
  Top 0.152: R3.2 38.25,30.02 41.76,33.53 42.82,33.53 44.2,32.16 44.35,32.16 46.33,30.18 46.33,29.57 T5.2
N$16
  Top 0.152: R10.1 37.95,16.76 37.95,19.2 T6.1
N$17  (via drill 0.38)
  Top 0.152: R8.2 24.84,20.12 24.84,22.1 R7.2 | R10.2 32,16.76 29.41,19.36 25.45,19.36 24.84,19.96 R8.2 | 18.14,26.67 17.98,26.82 17.98,28.96 R11.2 | v6.86,30.18 4.57,32.46 4.57,33.07 IC7.7 | v15.09,26.06 15.54,25.6 17.07,25.6 18.14,26.67 | 18.14,26.67 C1.2 R9.2 20.57,26.67 20.57,22.86 23.47,19.96 24.69,19.96 R8.2
  Bottom 0.152: v6.86,30.18 7.47,30.18 10.21,27.43 13.72,27.43 v15.09,26.06
N$18  (via drill 0.38)
  Top 0.152: 10.82,29.26 10.82,30.94 C6.1 | 10.82,29.26 10.82,28.19 C5.1 10.67,28.19 v10.67,26.67 | D2.C 19.51,28.8 19.2,28.8 18.29,29.72 17.53,29.72 16.76,28.96 R11.1 | 16.46,28.8 16.46,26.67 C1.1 | 16.46,28.8 R11.1 | 10.82,29.26 16,29.26 16.46,28.8 | 16.46,28.8 R11.1 | IC7.1 3.05,27.74 3.05,21.95 1.68,20.57 1.68,8.38 2.44,7.62 U$3.P$2
  Bottom 0.152: v10.67,26.67 10.67,15.7 2.59,7.62 U$3.P$2
N$19
  Top 0.152: U$2.2 U$2.4 123.9,38.1 123.9,34.75 125.27,33.38 125.27,17.07 120.09,11.89 | 120.09,11.89 124.36,7.62 U$4.P$1 | 120.09,11.89 111.86,20.12 111.86,29.11 D1.A
N$20
  Top 0.152: R15.1 102.26,23.77 103.63,25.15 103.63,25.91 102.87,26.67 102.41,26.67 IC2.2
N$21
  Top 0.152: U$1.1 10.67,33.53 R13.2
N$22  (via drill 0.38)
  Top 0.152: R14.2 82.3,32.77 86.41,36.88 90.37,36.88 94.49,41 v101.5,41
  Bottom 0.152: v101.5,41 104.7,41 109.42,45.72 110.19,45.72 T1.2
N$23
  Top 0.152: R35.1 90.68,16.61 86.41,16.61 86.11,16.92 S8.1
N$24
  Top 0.152: R16.1 105.92,26.67 105.92,27.43 102.87,30.48 102.41,30.48 IC2.5
N$25
  Top 0.152: R17.1 105.92,29.26 105.46,29.26 102.87,31.85 102.41,31.85 IC2.6
N$26
  Top 0.152: R18.1 105.92,35.66 102.41,35.66 IC2.9
N$27
  Top 0.152: R19.1 89.61,35.66 92.2,35.66 IC2.12
N$29
  Top 0.152: R15.2 97.23,22.86 95.71,24.38 94.79,24.38 91.75,21.34 91.75,20.88 88.85,17.98 78.94,17.98 74.37,13.41 72.69,13.41 T2.2
N$30
  Top 0.152: R16.2 107.29,26.67 107.29,26.21 103.17,22.1 97.38,22.1 96.01,23.47 95.25,23.47 T9.2
N$31
  Top 0.152: R17.2 107.29,29.26 104.09,32.46 96.16,32.46 93.73,30.02 87.33,30.02 84.73,27.43 84.73,24.38 79.25,18.9 69.19,18.9 66.29,16 T10.2
N$32  (via drill 0.38)
  Top 0.152: v100.13,35.2 101.19,36.27 106.68,36.27 107.29,35.66 R18.2 | v92.96,17.22 v94.79,19.05
  Bottom 0.152: v100.13,35.2 100.13,22.4 96.32,18.59 95.25,18.59 v94.79,19.05 | v92.96,17.22 77.88,2.13 68.58,2.13 66.14,4.57 65.38,4.57 T11.2
N$33  (via drill 0.38)
  Top 0.152: v76.2,23.62 76.96,23.62 77.57,24.23 77.57,25.76 78.33,26.52 79.4,26.52 81.53,28.65 81.53,29.72 87.33,35.51 88.24,35.51 R19.2
  Bottom 0.152: v76.2,23.62 75.44,23.62 74.98,24.08 69.19,24.08 66.14,21.03 T12.2
N$34  (via drill 0.38)
  Top 0.152: K3.1 92.51,16.46 92.2,16.46 R35.2 | v34.14,5.64 46.18,5.64 50.6,1.22 v78.79,1.22
  Bottom 0.152: v34.14,5.64 25.15,14.63 K2.1 | v78.79,1.22 92.2,14.63 94.18,14.63 K3.1
N$35
  Top 0.152: T2.1 72.69,10.21 72.69,7.01 R22.1
N$36
  Top 0.152: T9.1 97.08,21.03 97.08,19.05 R23.1
N$37
  Top 0.152: T10.1 67.82,13.72 67.82,8.99 R24.1
N$38
  Top 0.152: R25.1 67.82,7.32 67.82,4.12 66.6,2.9 T11.1
N$39  (via drill 0.38)
  Top 0.152: 69.19,6.4 69.19,7.32 R25.2 69.19,7.47 69.19,8.84 R24.2 | 69.19,6.4 69.19,5.64 R26.2 | 69.19,6.4 70.87,6.4 71.48,5.79 72.54,5.79 R22.2 72.69,5.79 78.33,11.43 78.33,12.8 78.49,12.95 80.16,12.95 81.08,12.04 C2.2 81.23,11.89 81.53,11.58 92.51,11.58 98.3,17.37 98.3,19.05 R23.2 v99.36,19.96 | v114.91,33.83 116.74,33.83 118.87,31.7 120.4,31.7 121.16,32.46 121.16,33.07 IC8.7
  Bottom 0.152: v114.91,33.83 114.91,32 102.87,19.96 v99.36,19.96
N$40
  Top 0.152: R26.1 70.56,5.49 71.63,5.49 72.08,5.03 73.15,5.03 77.27,9.14 77.27,9.91 79.25,11.89 C2.1 79.4,11.89 80.47,10.82 93.57,10.82 101.04,18.29 101.35,18.29 101.65,18.59 101.65,19.81 109.12,27.28 109.12,29.11 D1.C 109.27,29.26 110.64,29.26 113.08,31.7 114.61,31.7 | 114.61,31.7 114.61,28.04 C8.1 114.76,27.89 115.82,26.82 117.2,26.82 118.11,27.74 119.94,27.74 IC8.1 120.09,27.74 120.09,27.28 124.36,23.01 124.36,17.83 U$4.P$2 | 114.61,31.7 C7.1
N$42  (via drill 0.38)
  Top 0.152: v85.65,29.72 84.73,29.72 84.28,29.26 82.3,29.26 R21.2 | v97.69,29.72 98.91,29.72 101.19,27.43 104.09,27.43 105.61,25.91 106.53,25.91 106.68,26.06 106.68,27.43 108.51,29.26 108.51,34.59 112.01,38.1 112.01,38.56 113.84,40.39 U$2.1
  Bottom 0.152: v97.69,29.72 v85.65,29.72
N$45  (via drill 0.38)
  Top 0.152: v8.38,30.63 7.01,29.26 7.01,27.89 IC7.4
  Bottom 0.152: v8.38,30.63 18.75,30.63 31.09,18.29 T7.1
N$47  (via drill 0.38)
  Top 0.152: v113.08,33.07 117.04,33.07 118.72,31.39 120.85,31.39 123.75,28.5 123.75,27.89 IC8.4 | v104.09,34.44 103.48,33.83 94.64,33.83 93.27,32.46 89.31,32.46 84.43,27.58 84.43,24.54 79.1,19.2 67.51,19.2 67.36,19.05 T12.1
  Bottom 0.152: v113.08,33.07 112.78,33.07 111.4,34.44 v104.09,34.44
RHVTRIG
  Top 0.152: R21.1 80.77,29.11 80.16,29.11 77.27,26.21 75.13,26.21 74.22,25.3 74.22,24.54 73.76,24.08 70.56,24.08 70.1,24.54 70.1,24.84 69.04,25.91 68.73,25.91 IC5.3
RTS+
  Top 0.152: K3.8 95.56,4.57 94.03,3.05 90.98,3.05 90.07,2.13 X5.1
RTS-
  Top 0.152: K3.5 93.57,4.57 90.07,8.08 X5.3
RVSEL  (via drill 0.38)
  Top 0.152: v64.77,29.87 64.77,30.18 61.87,33.07 60.96,33.07 IC5.25 | v79.7,30.18 80.16,30.18 86.56,36.58 91.9,36.58 92.2,36.88 IC2.11
  Bottom 0.152: v64.77,29.87 79.4,29.87 v79.7,30.18
SCL  (via drill 0.38)
  Top 0.152: v66.29,30.63 67.97,32.31 68.58,32.31 IC5.13 | v59.28,30.33 55.93,33.68 52.12,33.68 49.23,30.79 49.23,30.33 48.01,29.11 47.85,29.11 46.94,28.19 46.94,21.03 50.29,17.68 53.95,17.68 55.17,16.46 v55.17,12.95 | v74.98,5.49 77.11,7.62 79.1,7.62 X3.2
  Bottom 0.152: v66.29,30.63 63.09,30.63 62.79,30.33 v59.28,30.33 | X2.2 46.33,7.62 47.09,6.86 48.16,6.86 54.25,12.95 v55.17,12.95 61.27,6.86 64.47,6.86 65.84,5.49 v74.98,5.49
SDA  (via drill 0.38)
  Top 0.152: v71.32,34.29 71.32,33.98 69.19,31.85 68.73,31.85 IC5.12 | v101.19,16.31 100.74,16.31 95.1,10.67 93.88,10.67 92.96,9.75 80.77,9.75 80.01,8.99 | 80.01,8.99 79.25,9.75 78.03,9.75 77.57,9.3 77.57,8.99 70.1,1.52 50.75,1.52 44.5,7.77 44.5,9.3 44.96,9.75 45.87,9.75 46.63,8.99 46.94,8.99 X2.3 | 80.01,8.99 X3.3
  Bottom 0.152: v71.32,34.29 71.78,34.29 77.72,40.23 103.02,40.23 108.51,34.75 114.91,34.75 115.67,33.98 115.67,31.7 101.19,17.22 v101.19,16.31
SPKR
  Top 0.152: R14.1 70.71,32.77 69.19,31.24 68.73,31.24 IC5.11
TCK  (via drill 0.38)
  Top 0.152: IC5.35 60.96,26.52 61.42,26.52 62.79,25.15 62.79,24.54 62.18,23.93 61.42,23.93 59.59,22.1 59.59,18.59 60.2,17.98 60.2,16.61 R32.1 60.35,16.46 60.35,16 60.96,15.39 60.96,13.26 v60.66,12.95 | S5.2 20.57,39.32 18.9,41 15.39,41 0.61,55.78 0.61,57.3 1.22,57.91 1.22,58.37 TP4.TP 1.22,58.52 0.61,59.13 0.61,62.33 1.07,62.79 1.52,62.79 4.88,59.44 4.88,58.52 15.7,47.7 15.85,47.7 20.27,43.28 20.57,43.28 C18.1 | v33.53,19.05 v35.05,17.53
  Bottom 0.152: v60.66,12.95 60.35,12.95 59.28,14.02 47.55,14.02 43.89,17.68 35.2,17.68 v35.05,17.53 | v33.53,19.05 32.92,19.05 26.21,25.76 25.3,25.76 15.09,35.97 15.09,40.39 15.7,41 18.9,41 20.57,39.32 S5.2
TDI  (via drill 0.38)
  Top 0.152: C20.1 79.1,25.3 79.1,22.4 S7.2 | v19.36,42.82 18.9,42.82 18.14,43.59 18.14,43.74 1.37,60.5 1.37,60.96 TP2.TP | 59.28,25.15 60.81,25.15 IC5.37 | 59.74,12.95 59.28,13.41 59.28,25.15 | 59.74,12.95 60.2,12.5 60.2,11.43 R34.1 | 59.28,25.15 v58.98,25.15 | v84.12,12.95 v81.99,15.09 | 59.74,12.95 v59.59,12.8
  Bottom 0.152: v19.36,42.82 23.32,38.86 23.32,34.75 34.44,23.62 42.52,23.62 42.98,24.08 47.09,24.08 48.16,25.15 v58.98,25.15 | v81.99,15.09 79.1,17.98 79.1,22.25 S7.2 | v84.12,12.95 84.12,8.84 81.53,6.25 65.53,6.25 64.62,7.16 62.79,7.16 58.52,11.43 58.52,11.73 v59.59,12.8
TDO  (via drill 0.38)
  Top 0.152: S8.3 86.56,21.64 89.46,21.64 R36.1 | v66.45,7.47 65.84,8.08 65.84,8.84 C21.1 | v18.9,43.74 4.57,58.06 4.57,58.52 1.37,61.72 1.37,62.18 TP1.TP | v62.03,24.69 60.96,24.69 IC5.38 | v59.28,11.58 59.28,12.19 57.15,14.33 57.15,19.05 v58.22,20.12
  Bottom 0.152: S8.3 83.36,19.36 83.36,8.53 81.38,6.55 70.26,6.55 69.34,7.47 v66.45,7.47 63.4,7.47 v59.28,11.58 | v18.9,43.74 19.36,43.74 23.62,39.47 23.62,34.9 27.28,31.24 42.67,31.24 43.59,32.16 54.56,32.16 v62.03,24.69 60.81,23.47 60.81,22.71 v58.22,20.12
TEST  (via drill 0.38)
  Top 0.152: v4.42,55.93 1.37,55.93 TP6.TP | v57.76,30.33 v56.24,31.85 | v67.36,25.45 68.12,24.69 68.58,24.69 IC5.1 | v75.59,24.38 75.59,25.3 R20.1
  Bottom 0.152: v4.42,55.93 13.87,55.93 15.7,57.76 21.95,57.76 27.43,52.27 27.43,46.94 39.01,35.36 52.73,35.36 v56.24,31.85 | v57.76,30.33 58.37,30.33 63.25,25.45 v67.36,25.45 68.43,24.38 v75.59,24.38
TMS  (via drill 0.38)
  Top 0.152: C19.1 105.46,42.98 107.14,42.98 110.8,39.32 S6.2 | v3.05,57.91 TP3.TP | v59.74,25.91 60.81,25.91 IC5.36 | v60.2,15.24 60.2,14.02 R33.1 | v101.96,17.07 101.96,16.15 v98.15,12.34 | v90.83,12.34 84.43,12.34 84.28,12.19 82.75,12.19 81.69,13.26 v75.13,13.26
  Bottom 0.152: v3.05,57.91 3.05,35.05 10.36,27.74 18.44,27.74 29.11,17.07 33.68,17.07 34.9,18.29 41.76,18.29 47.85,24.38 52.58,24.38 | 52.58,24.38 59.13,24.38 59.74,24.99 v59.74,25.91 | 52.58,24.38 52.58,21.03 54.86,18.75 57.91,18.75 60.2,16.46 v60.2,15.24 60.5,14.94 72.39,14.94 74.07,13.26 v75.13,13.26 | v101.96,17.07 115.98,31.09 115.98,35.97 115.06,36.88 113.23,36.88 110.95,39.17 S6.2 | v90.83,12.34 v98.15,12.34
VCC  (via drill 0.38)
  Top 0.152: 123.6,51.82 122.07,50.29 121.46,50.29 115.98,44.81 115.98,43.59 IC3.3 | 123.6,51.82 v121.77,53.65 | 123.6,51.82 L3.1 | v80.77,31.7 78.18,31.7 R6.2 | 71.63,20.12 79.55,20.12 84.12,24.69 84.12,28.19 v84.89,28.96 | 70.26,11.28 68.58,12.95 68.58,14.33 67.97,14.94 65.84,14.94 65.38,15.39 65.38,18.29 66.29,19.2 66.29,19.36 67.06,20.12 71.63,20.12 | 70.26,11.28 v71.32,10.21 | 71.63,20.12 C10.1 | 70.26,11.28 68.58,9.6 68.58,8.38 68.28,8.08 67.51,8.08 67.21,7.77 67.21,4.72 64.31,1.83 63.7,1.83 59.89,5.64 47.09,5.64 45.26,7.47 45.26,8.84 X2.1
  Bottom 0.152: SG1.2 114.45,63.86 114.45,60.96 v121.77,53.65 121.77,33.83 102.26,14.33 | 39.62,10.67 35.66,14.63 32.77,14.63 K2.12 | 39.62,10.67 41.3,8.99 45.26,8.99 X2.1 | K2.7 32.77,3.2 37.95,8.38 37.95,8.99 39.62,10.67 | v80.77,31.7 82.75,31.7 85.19,29.26 | 85.19,29.26 85.5,28.96 86.56,28.96 89,26.52 89,23.01 86.56,20.57 85.19,20.57 84.43,19.81 84.43,19.2 85.65,17.98 98.6,17.98 K3.12 | 85.19,29.26 v84.89,28.96 | v71.32,10.21 72.54,8.99 78.33,8.99 X3.1 | K3.12 102.26,14.33 | 102.26,14.33 102.87,13.72 102.87,4.27 101.96,3.35 101.96,2.13 K3.7 | 101.96,14.63 K3.12
XIN
  Top 0.152: IC5.6 68.73,27.89 71.63,27.89 72.39,28.65 Q3.2 72.39,28.8 71.48,29.72 71.48,30.48 C12.1
XOUT
  Top 0.152: 71.02,25.76 71.32,25.45 C11.1 71.02,25.76 | 71.02,25.76 69.65,27.13 68.73,27.13 IC5.5 | 71.02,25.76 71.17,25.76 72.39,26.98 Q3.1